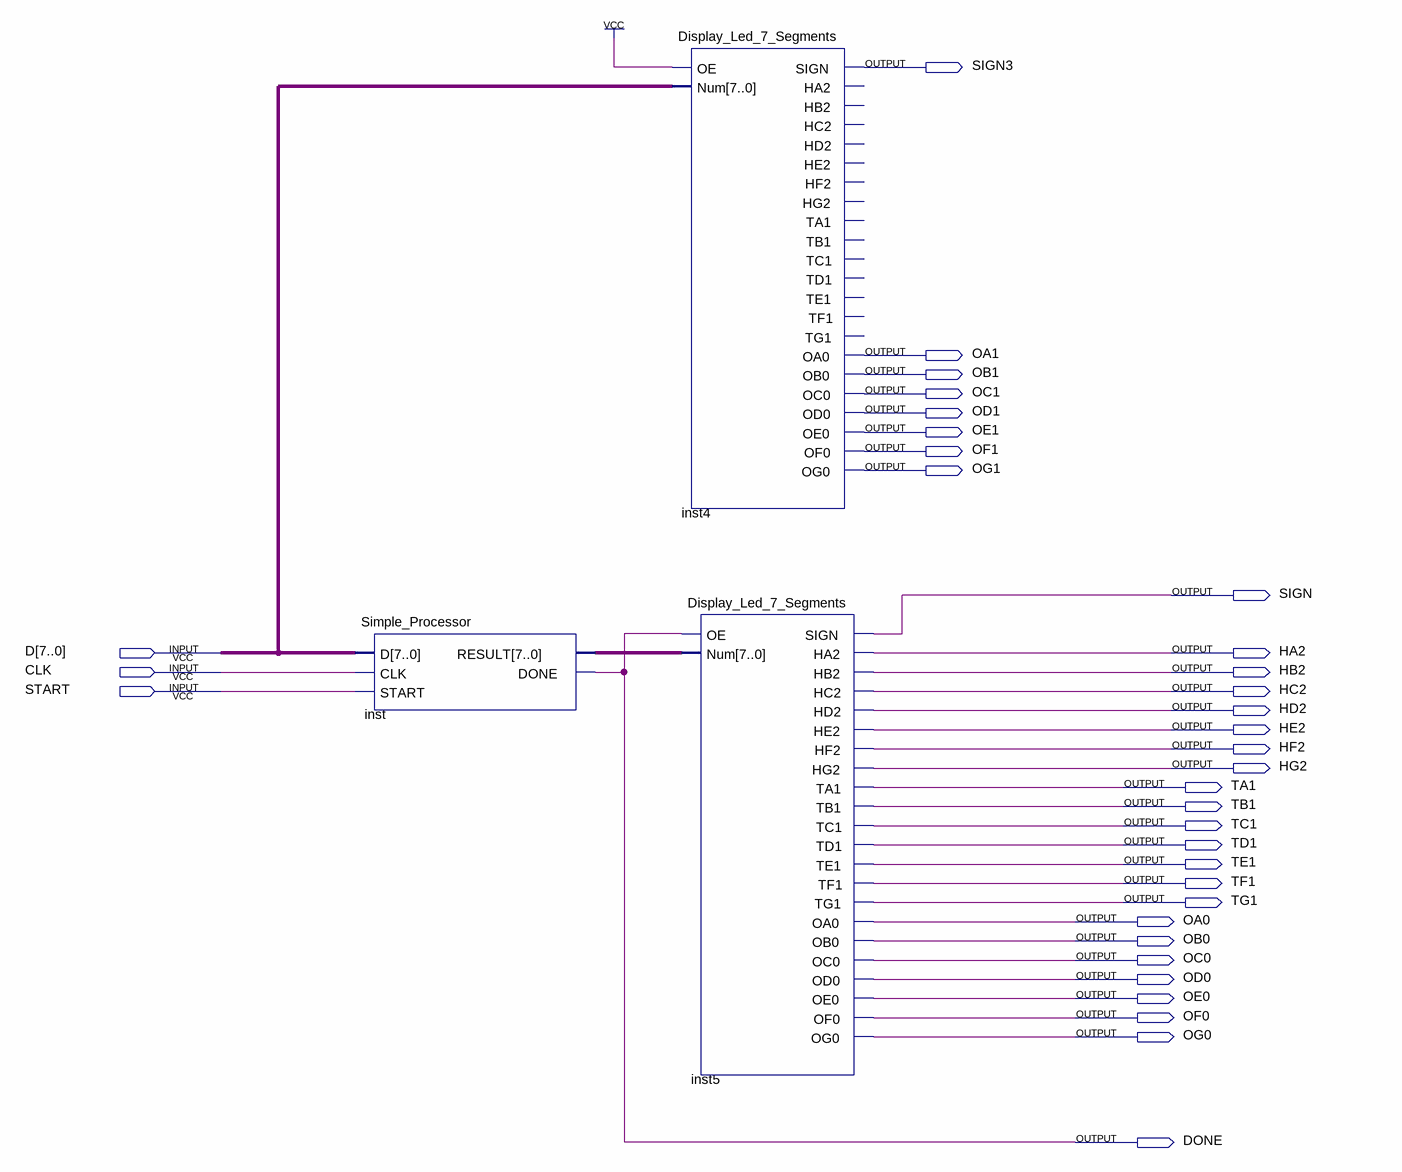
[diagram p0: schematic sheet]
// Quartus schematic NAP_KIT_DE2.bdf as structural Verilog: 3 symbols, 34 pins
module NAP_KIT_DE2 (
  input  [7:0] D,
  input  CLK,
  input  START,
  output SIGN3,
  output OA1,
  output OB1,
  output OC1,
  output OD1,
  output OE1,
  output OF1,
  output OG1,
  output SIGN,
  output HA2,
  output HB2,
  output HC2,
  output HD2,
  output HE2,
  output HF2,
  output HG2,
  output TA1,
  output TB1,
  output TC1,
  output TD1,
  output TE1,
  output TF1,
  output TG1,
  output OA0,
  output OB0,
  output OC0,
  output OD0,
  output OE0,
  output OF0,
  output OG0,
  output DONE
);

  wire [7:0] inst_result;

  Simple_Processor inst (.D(D), .CLK(CLK), .START(START), .RESULT(inst_result), .DONE(DONE));
  Display_Led_7_Segments inst4 (
    .OE(1'b1), .Num(D), .SIGN(SIGN3), .OA0(OA1), .OB0(OB1), .OC0(OC1), .OD0(OD1), .OE0(OE1), .OF0(OF1),
    .OG0(OG1));  // open: HA2, HB2, HC2, HD2, HE2, HF2, HG2, TA1, TB1, TC1, TD1, TE1, TF1, TG1
  Display_Led_7_Segments inst5 (
    .OE(DONE), .Num(inst_result), .HA2(HA2), .HB2(HB2), .HC2(HC2), .HD2(HD2), .HE2(HE2), .HF2(HF2),
    .SIGN(SIGN), .HG2(HG2), .TA1(TA1), .TB1(TB1), .TC1(TC1), .TD1(TD1), .TE1(TE1), .TF1(TF1), .TG1(TG1),
    .OA0(OA0), .OB0(OB0), .OC0(OC0), .OD0(OD0), .OE0(OE0), .OF0(OF0), .OG0(OG0));
endmodule
